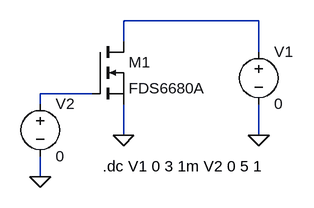
[diagram p0: schematic MosTst.asc]
MosTst.asc, the LTspice schematic file:
Version 4
SHEET 1 880 680
WIRE 208 416 208 368
WIRE 208 272 208 240
WIRE 208 240 416 240
WIRE 416 240 416 288
WIRE 416 368 416 416
WIRE 80 480 80 448
WIRE 80 368 80 352
WIRE 80 352 160 352
FLAG 416 416 0
FLAG 208 416 0
FLAG 80 480 0
SYMBOL nmos 160 272 R0
SYMATTR InstName M1
SYMATTR Value FDS6680A
SYMBOL voltage 416 272 R0
SYMATTR InstName V1
SYMATTR Value 0
SYMBOL voltage 80 352 R0
SYMATTR InstName V2
SYMATTR Value 0
TEXT 176 464 Left 0 !.dc V1 0 3 1m V2 0 5 1

The netlist it stands for:
* MosTst.asc
M1 N001 N002 0 0 FDS6680A
V1 N001 0 0
V2 N002 0 0
.model NMOS NMOS
.model PMOS PMOS
.lib standard.mos
.dc V1 0 3 1m V2 0 5 1
.backanno
.end